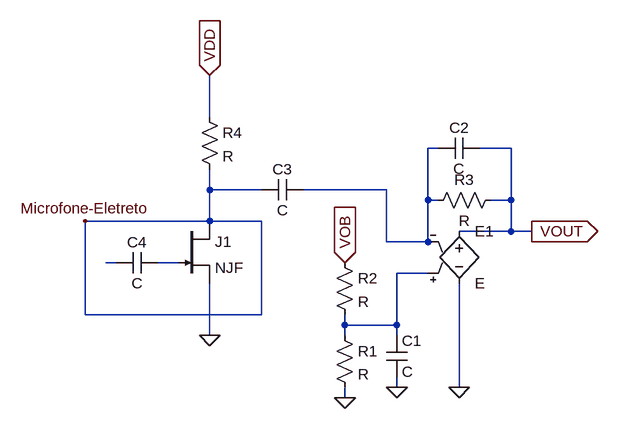
[diagram p0: schematic Amp.asc]
Amp.asc, the LTspice schematic file:
Version 4
SHEET 1 880 680
WIRE -208 -32 -208 -96
WIRE 144 16 128 16
WIRE 256 16 208 16
WIRE -208 80 -208 48
WIRE -128 80 -208 80
WIRE 64 80 -64 80
WIRE 128 96 128 16
WIRE 144 96 128 96
WIRE 256 96 256 16
WIRE 256 96 224 96
WIRE -208 128 -208 80
WIRE -208 128 -400 128
WIRE -128 128 -208 128
WIRE 256 144 256 96
WIRE 256 144 176 144
WIRE 288 144 256 144
WIRE 64 160 64 80
WIRE 128 160 128 96
WIRE 128 160 64 160
WIRE -352 192 -368 192
WIRE -256 192 -288 192
WIRE 128 208 80 208
WIRE -400 272 -400 128
WIRE -128 272 -128 128
WIRE -128 272 -400 272
WIRE 0 288 0 272
WIRE 80 288 80 208
WIRE 80 288 0 288
WIRE -208 304 -208 224
WIRE 0 304 0 288
WIRE 80 304 80 288
WIRE 80 384 80 368
WIRE 176 384 176 224
WIRE 0 400 0 384
FLAG 80 384 0
FLAG 0 400 0
FLAG 0 192 VOB
IOPIN 0 192 In
FLAG 288 144 VOUT
IOPIN 288 144 Out
FLAG -208 -96 VDD
IOPIN -208 -96 In
FLAG -208 304 0
FLAG -400 128 Microfone-Eletreto
FLAG 176 384 0
SYMBOL e2 176 128 R0
SYMATTR InstName E1
SYMBOL cap 64 304 R0
SYMATTR InstName C1
SYMBOL res -16 288 R0
SYMATTR InstName R1
SYMBOL res -16 176 R0
SYMATTR InstName R2
SYMBOL res 240 80 R90
WINDOW 0 0 56 VBottom 2
WINDOW 3 32 56 VTop 2
SYMATTR InstName R3
SYMBOL cap 208 0 R90
WINDOW 0 0 32 VBottom 2
WINDOW 3 32 32 VTop 2
SYMATTR InstName C2
SYMBOL cap -64 64 R90
WINDOW 0 0 32 VBottom 2
WINDOW 3 32 32 VTop 2
SYMATTR InstName C3
SYMBOL res -224 -48 R0
SYMATTR InstName R4
SYMBOL njf -256 128 R0
SYMATTR InstName J1
SYMBOL cap -288 176 R90
WINDOW 0 0 32 VBottom 2
WINDOW 3 32 32 VTop 2
SYMATTR InstName C4

The netlist it stands for:
* Amp.asc
E1 VOUT 0 N004 N001 E
C1 N004 0 C
R1 N004 0 R
R2 VOB N004 R
R3 VOUT N001 R
C2 VOUT N001 C
C3 N001 Microfone-Eletreto C
R4 VDD Microfone-Eletreto R
J1 Microfone-Eletreto N003 0 NJF
C4 N003 N002 C
.model NJF NJF
.model PJF PJF
.lib standard.jft
.backanno
.end